# EAGLE design ESP8266-Thing-Dev (EAGLE 9.1.0)
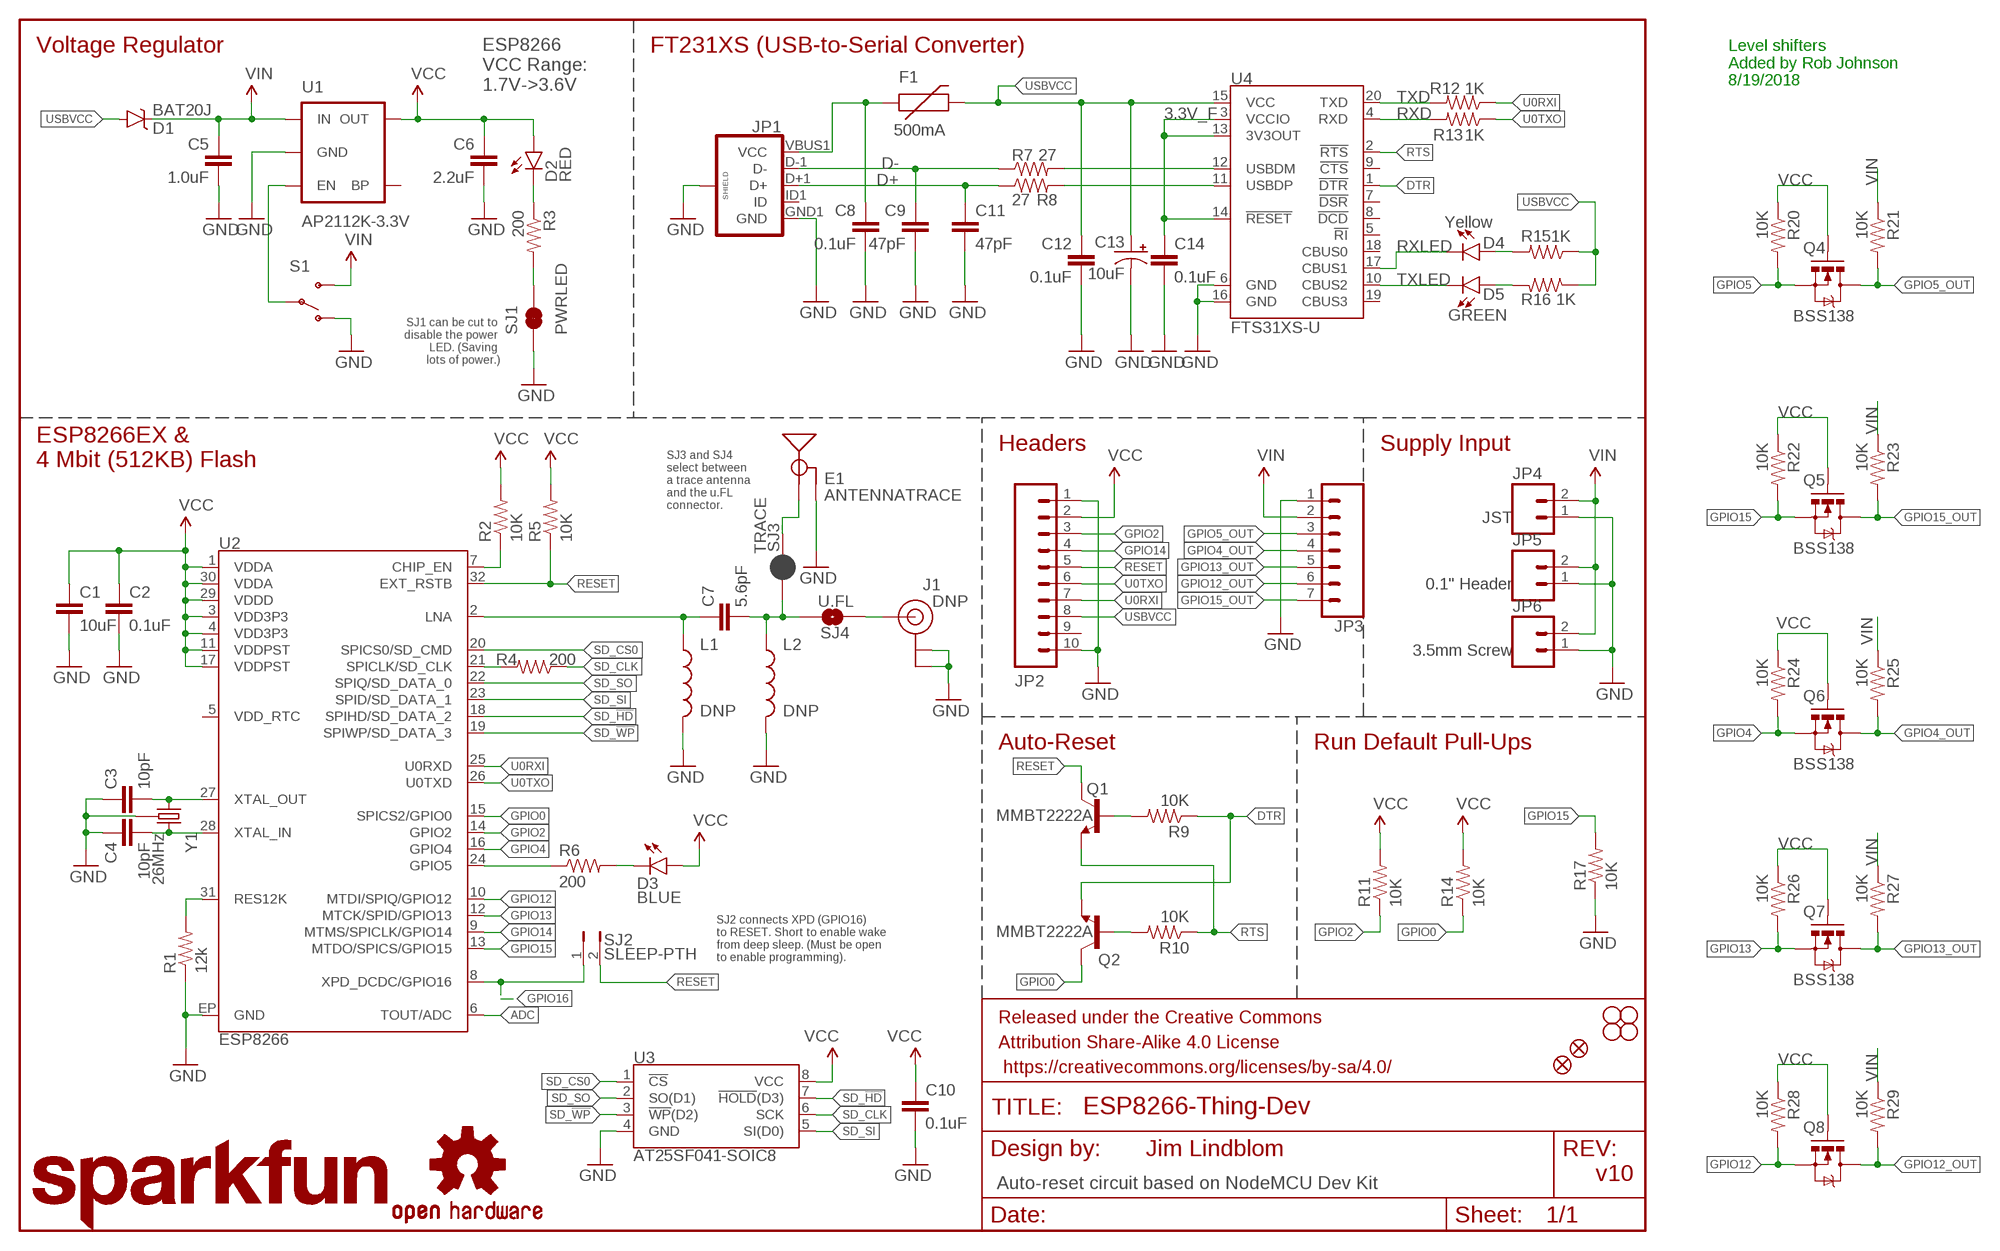
[diagram p0: schematic, sheet 1]

## Parts
C1  10uF  10UF-6.3V-20%(0603)  [0603-CAP]
C2  0.1uF  0.1UF-25V(+80/-20%)(0603)  [0603-CAP]
C3  10pF  10PF-50V-5%(0603)  [0603-CAP]
C4  10pF  10PF-50V-5%(0603)  [0603-CAP]
C5  1.0uF  1.0UF-25V-+80/-20(0805)  [0805]
C6  2.2uF  2.2UF-10V-20%(0603)  [0603-CAP]
C7  5.6pF  CAP0603-CAP  [0603-CAP]
C8  0.1uF  0.1UF-25V(+80/-20%)(0603)  [0603-CAP]
C9  47pF  47PF-50V-5%(0603)  [0603-CAP]
C10  0.1uF  0.1UF-25V(+80/-20%)(0603)  [0603-CAP]
C11  47pF  47PF-50V-5%(0603)  [0603-CAP]
C12  0.1uF  0.1UF-25V(+80/-20%)(0603)  [0603-CAP]
C13  10uF  10UF-16V-10%(TANT)  [EIA3216]
C14  0.1uF  0.1UF-25V(+80/-20%)(0603)  [0603-CAP]
D1  BAT20J  DIODE-SCHOTTKY-BAT20J  [SOD-323]
D2  RED  LED-RED0603  [LED-0603]
D3  BLUE  LED-BLUE0603  [LED-0603]
D4  Yellow  LED-YELLOW0603  [LED-0603]
D5  GREEN  LED-GREEN0603  [LED-0603]
E1  ANTENNATRACE  [TRACE_ANTENNA_2.4GHZ_25.7MM]
F1  500mA  PTCSMD  [PTC-1206]
FID1  FIDUCIAL1X2  [FIDUCIAL-1X2]
FID2  FIDUCIAL1X2  [FIDUCIAL-1X2]
FRAME1  FRAME-LETTER  [CREATIVE_COMMONS]
J1  DNP  U.FL  [U.FL]
JP1  USB_MICROB_PLUGCONN-11752  [USB-B-MICRO-SMD_V03]
JP2  M10NO_SILK_PTH_FEMALE  [1X10_NO_SILK]
JP3  CONN_07NO_SILK  [1X07_NO_SILK]
JP4  M02JST-PTH-2  [JST-2-PTH]
JP5  M021X02_NO_SILK  [1X02_NO_SILK]
JP6  M023.5MM-NO_SILK  [SCREWTERMINAL-3.5MM-2-NS]
L1  DNP  INDUCTOR0603  [0603]
L2  DNP  INDUCTOR0603  [0603]
LOGO1  SFE_LOGO_NAME.2_INCH  [SFE_LOGO_NAME_.2]
LOGO2  OSHW-LOGOS  [OSHW-LOGO-S]
Q1  MMBT2222A  TRANSISTOR_NPNMMBT2222A  [SOT23-3]
Q2  MMBT2222A  TRANSISTOR_NPNMMBT2222A  [SOT23-3]
Q4  BSS138  MOSFET-NCHANNELSMD  [SOT23-3]
Q5  BSS138  MOSFET-NCHANNELSMD  [SOT23-3]
Q6  BSS138  MOSFET-NCHANNELSMD  [SOT23-3]
Q7  BSS138  MOSFET-NCHANNELSMD  [SOT23-3]
Q8  BSS138  MOSFET-NCHANNELSMD  [SOT23-3]
R1  12k  12KOHM-1/10W-1%(0603)  [0603-RES]
R2  10K  10KOHM1/10W1%(0603)0603  [0603-RES]
R3  200  200OHM1/10W1%(0603)  [0603-RES]
R4  200  200OHM1/10W1%(0603)  [0603-RES]
R5  10K  10KOHM1/10W1%(0603)0603  [0603-RES]
R6  200  200OHM1/10W1%(0603)  [0603-RES]
R7  27  27OHM1/10W1%(0603)0603-RES  [0603-RES]
R8  27  27OHM1/10W1%(0603)0603-RES  [0603-RES]
R9  10K  10KOHM1/10W1%(0603)0603  [0603-RES]
R10  10K  10KOHM1/10W1%(0603)0603  [0603-RES]
R11  10K  10KOHM1/10W1%(0603)0603  [0603-RES]
R12  1K  1KOHM-1/10W-1%(0603)  [0603-RES]
R13  1K  1KOHM-1/10W-1%(0603)  [0603-RES]
R14  10K  10KOHM1/10W1%(0603)0603  [0603-RES]
R15  1K  1KOHM-1/10W-1%(0603)  [0603-RES]
R16  1K  1KOHM-1/10W-1%(0603)  [0603-RES]
R17  10K  10KOHM1/10W1%(0603)0603  [0603-RES]
R20  10K  RESISTOR0603-RES  [0603-RES]
R21  10K  RESISTOR0603-RES  [0603-RES]
R22  10K  RESISTOR0603-RES  [0603-RES]
R23  10K  RESISTOR0603-RES  [0603-RES]
R24  10K  RESISTOR0603-RES  [0603-RES]
R25  10K  RESISTOR0603-RES  [0603-RES]
R26  10K  RESISTOR0603-RES  [0603-RES]
R27  10K  RESISTOR0603-RES  [0603-RES]
R28  10K  RESISTOR0603-RES  [0603-RES]
R29  10K  RESISTOR0603-RES  [0603-RES]
S1  SWITCH-SPDT-SMD-A  [SWITCH-SPST-SMD-A]
SJ1  PWRLED  JUMPER-PAD-2-NC_BY_TRACE  [PAD-JUMPER-2-NC_BY_TRACE_YES_SILK]
SJ2  SLEEP-PTH  JUMPER-PTH-2-NO  [PTH-JUMPER-2-NO_NO_SILK]
SJ3  TRACE  JUMPER-PAD-2-NC_BY_PASTENO-SILK  [PAD-JUMPER-2-NC_BY_PASTE_NO_SILK]
SJ4  U.FL  JUMPER-PAD-2-NO  [PAD-JUMPER-2-NO_NO_SILK]
STANDOFF1  STAND-OFF  [STAND-OFF]
STANDOFF2  STAND-OFF  [STAND-OFF]
STANDOFF3  STAND-OFF  [STAND-OFF]
STANDOFF4  STAND-OFF  [STAND-OFF]
U1  AP2112K-3.3V  V_REG_LDOSMD  [SOT23-5]
U2  ESP8266  [QFN32]
U3  AT25SF041-SOIC8  [SO08]
U4  FTS31XS-U  FT231XS  [SSOP20_L]
Y1  26MHz  CRYSTAL-GROUNDED3.2X2.5  [CRYSTAL-SMD-3.2X2.5]

## Nets
3.3V_F: C14.1 U4.3(VCCIO) U4.13(3V3OUT) U4.14(!RESET)
ADC: U2.6(TOUT/ADC)
ANT: J1.P$3(SIGNAL) SJ4.1
CHIP_EN: R2.1 U2.7(CHIP_EN)
D+: C11.1 JP1.D+1(D+) R8.1
D-: C9.1 JP1.D-1(D-) R7.1
DTR: Q2.2(E) R9.1 U4.1(!DTR)
GND: C1.2 C2.2 C3.1 C4.1 C5.2 C6.2 C8.2 C9.2 C10.2 C11.2 C12.2 C13.C(-) C14.2 E1.GND E1.GND2(GND) J1.P$1(GND) J1.P$2(GND) JP1.GND1(GND) JP1.SHIELD1(SHIELD) JP1.SHIELD2(SHIELD) JP1.SHIELD3(SHIELD) JP2.1 JP2.10 JP3.1 JP4.1 JP5.1 JP6.1 L1.2 L2.2 R1.1 R17.1 S1.1(O) SJ1.1 U1.2(GND) U2.EP(GND) U3.4(GND) U4.6(GND) U4.16(GND) Y1.2(GND) Y1.4(GND)
GPIO0: Q2.3(C) R14.1 U2.15(SPICS2/GPIO0)
GPIO2: JP2.3 R11.1 U2.14(GPIO2)
GPIO4: Q6.2(S) R24.2 U2.16(GPIO4)
GPIO4_OUT: JP3.4 Q6.3(D) R25.2
GPIO5: Q4.2(S) R6.1 R20.2 U2.24(GPIO5)
GPIO5_OUT: JP3.3 Q4.3(D) R21.2
GPIO12: Q8.2(S) R28.2 U2.10(MTDI/SPIQ/GPIO12)
GPIO12_OUT: JP3.6 Q8.3(D) R29.2
GPIO13: Q7.2(S) R26.2 U2.12(MTCK/SPID/GPIO13)
GPIO13_OUT: JP3.5 Q7.3(D) R27.2
GPIO14: JP2.4 U2.9(MTMS/SPICLK/GPIO14)
GPIO15: Q5.2(S) R17.2 R22.2 U2.13(MTDO/SPICS/GPIO15)
GPIO15_OUT: JP3.7 Q5.3(D) R23.2
GPIO16: SJ2.1 U2.8(XPD_DCDC/GPIO16)
LNA: C7.1 L1.1 U2.2(LNA)
LNA2: C7.2 L2.1 SJ3.1 SJ4.2
N$1: R1.2 U2.31(RES12K)
N$2: C4.2 U2.28(XTAL_IN) Y1.3
N$3: C3.2 U2.27(XTAL_OUT) Y1.1
N$4: R7.2 U4.12(USBDM)
N$5: R3.2 SJ1.2
N$6: Q1.1(B) R9.2
N$7: R8.2 U4.11(USBDP)
N$8: D5.A R16.2
N$9: D3.C R6.2
N$10: D4.A R15.2
N$11: D2.C R3.1
N$12: Q2.1(B) R10.2
N$14: S1.2(P) U1.3(EN)
RESET: JP2.5 Q1.3(C) R5.1 SJ2.2 U2.32(EXT_RSTB)
RTS: Q1.2(E) R10.1 U4.2(!RTS)
RXD: R13.2 U4.4(RXD)
RXLED: D4.C U4.17(CBUS1)
SD_!HD!: U2.18(SPIHD/SD_DATA_2) U3.7(!HOLD!(D3))
SD_!WP!: U2.19(SPIWP/SD_DATA_3) U3.3(!WP!(D2))
SD_CLK: R4.1 U3.6(SCK)
SD_CLK0: R4.2 U2.21(SPICLK/SD_CLK)
SD_CS0: U2.20(SPICS0/SD_CMD) U3.1(!CS!)
SD_SI: U2.23(SPID/SD_DATA_1) U3.5(SI(D0))
SD_SO: U2.22(SPIQ/SD_DATA_0) U3.2(SO(D1))
TRACE_ANT: E1.ANT(SIGNAL) SJ3.2
TXD: R12.2 U4.20(TXD)
TXLED: D5.C U4.10(CBUS2)
U0RXI: JP2.7 R12.1 U2.25(U0RXD)
U0TXO: JP2.6 R13.1 U2.26(U0TXD)
USBVCC: C12.1 C13.A(+) D1.A F1.2 JP2.8 R15.1 R16.1 U4.15(VCC)
VCC: C1.1 C2.1 C6.1 C10.1 D2.A D3.A JP2.2 Q4.1(G) Q5.1(G) Q6.1(G) Q7.1(G) Q8.1(G) R2.2 R5.2 R11.2 R14.2 R20.1 R22.1 R24.1 R26.1 R28.1 U1.5(OUT) U2.1(VDDA) U2.3(VDD3P3) U2.4(VDD3P3) U2.11(VDDPST) U2.17(VDDPST) U2.29(VDDD) U2.30(VDDA) U3.8(VCC)
VIN: C5.1 D1.C JP3.2 JP4.2 JP5.2 JP6.2 R21.1 R23.1 R25.1 R27.1 R29.1 S1.3(S) U1.1(IN)
VUSB: C8.1 F1.1 JP1.VBUS1(VCC)
Unconnected: JP1.ID1(ID) JP2.9 U1.4(BP) U2.5(VDD_RTC) U4.5(!RI) U4.7(!DSR) U4.8(!DCD) U4.9(!CTS) U4.18(CBUS0) U4.19(CBUS3)

## Notes on the sheet
- Voltage Regulator | FT231XS (USB-to-Serial Converter)
- Level shifters
  Added by Rob Johnson
  8/19/2018
- ESP8266
  VCC Range:
  1.7V->3.6V
- SJ1 can be cut to 
  disable the power 
  LED. (Saving 
  lots of power.)
- SJ3 and SJ4
  select between
  a trace antenna
  and the u.FL 
  connector.
- Headers | Supply Input
- ESP8266EX &
  4 Mbit (512KB) Flash
- JST
- 0.1" Header
- DNP
- 3.5mm Screw
- Auto-Reset | Run Default Pull-Ups
- SJ2 connects XPD (GPIO16) 
  to RESET. Short to enable wake 
  from deep sleep. (Must be open
  to enable programming).
- Jim Lindblom
- v10
- Auto-reset circuit based on NodeMCU Dev Kit

## Library data of the parts
C1 = SparkFun-Capacitors:10UF-6.3V-20%(0603): CAP-11015; PROD_ID: CAP-11015
C2 C8 C10 C12 C14 = SparkFun-Capacitors:0.1UF-25V(+80/-20%)(0603): CAP-00810 Ceramic Standard decoupling cap; PROD_ID: CAP-00810
C3 C4 = SparkFun-Capacitors:10PF-50V-5%(0603): CAP-11812; PROD_ID: CAP-11812
C5 = SparkFun-Capacitors:1.0UF-25V-+80/-20(0805): CAP-11625; PROD_ID: CAP-11625
C6 = SparkFun-Capacitors:2.2UF-10V-20%(0603): CAP-07888; PROD_ID: CAP-07888
C7 = SparkFun-Capacitors:CAP: Capacitor Standard 0603 ceramic capacitor, and 0.1" leaded capacitor.; PROD_ID: CAP-12456
C9 C11 = SparkFun-Capacitors:47PF-50V-5%(0603): CAP-08913; PROD_ID: CAP-08913
C13 = SparkFun-Capacitors:10UF-16V-10%(TANT): CAP-00811 1206/EIA-3216 Tantalum capacitor; PROD_ID: CAP-00811
D1 = SparkFun-DiscreteSemi:DIODE-SCHOTTKY: Schottky diodes in SFE's production catalog BAT20J 1A 23V 0.62Vf RB751 120mA 40V 0.37Vf PMEG4005EJ 0.5A 40V 0.42Vf MBRA140 1A 40V 0.5Vf B340A 3A 40V SMA; PROD_ID: DIO-11623
D2 = SparkFun-LED:LED-RED: Assorted Red LEDs LilyPad 1206- DIO-09912 1206- DIO-00809 0603- DIO-00819 "SMART" means more efficient and expensive; PROD_ID: DIO-00819
D3 = SparkFun-LED:LED-BLUE: Blue LEDs for production use Various blue LEDs stocked by SparkFun production 0603 - DIO-08575 Rebel - DIO-09553 1206 - DIO-09911; PROD_ID: DIO-08575
D4 = SparkFun-LED:LED-YELLOW: Yellow SMD LEDs LilyPad 1206- DIO-09909 0603- DIO-09003 "SMART" means more efficient and expensive; PROD_ID: DIO-09003
D5 = SparkFun-LED:LED-GREEN: Various green LEDs Green LEDs used in SFE Production 0603- DIO-00821 LARGE- DIO-00862 LILYPAD- DIO-09910; PROD_ID: DIO-00821
E1 = SparkFun-RF:ANTENNA: Chip antenna Chip antenna with ground or secondary connection. Common with larger metal RF connectors.
F1 = SparkFun-PowerIC:PTC: Resettable Fuse PTC Resettable Fuse. Spark Fun Electronics SKU : COM-08357; PROD_ID: RES-11150
FID1 FID2 = SparkFun-Aesthetics:FIDUCIAL: Fiducial Alignment Points Various fiducial points for machine vision alignment.
FRAME1 = SparkFun-Aesthetics:FRAME-LETTER: Schematic Frame Standard 8.5x11 US Letter frame
J1 = SparkFun-Connectors:U.FL: SMD antenna connector- WRL-09144; PROD_ID: CONN-09193; VALUE: U.FL
JP1 = SparkFun-Connectors:USB_MICROB_PLUG: USB Micro-B connectors Some male, some female. Watch your step!; PROD_ID: CONN-11752
JP2 = SparkFun-Connectors:M10: Header 10 Standard 10-pin 0.1" header. Use with straight break away headers (SKU : PRT-00116), right angle break away headers (PRT-00553), swiss pins (PRT-00743), machine pins (PRT-00117), and female headers (PRT-00115).; PROD_ID: CONN-11563
JP3 = SparkFun-Connectors:CONN_07: Multi connection point. Often used as Generic Header-pin footprint for 0.1 inch spaced/style header connections On any of the 0.1 inch spaced packages, you can populate with these: Break Away Headers - Straight <https://www.sparkfun.com/products/116> (PRT-00116) Break Away Male Headers - Right Angle <https://www.sparkfun.com/products/553> (PRT-00553) Female Headers <https://www.sparkfun.com/products/115> (PRT-00115) Break Away Headers - Machine Pin <https://www.sparkfun.com/products/117> (PRT-00117) Break Away Female Headers - Swiss Machine Pin <https://www.sparkfun.com/products/743> (PRT-00743) For SCREWTERMINALS and SPRING TERMINALS visit here: Screw Terimnals on SparkFun.com <https://www.sparkfun.com/search/results?term=Screw+Terminals> (5mm/3.5mm/2.54mm spacing) This device is also useful as a general connection point to wire up your design to another part of your project. Our various solder wires solder well into these plated through hole pads. Hook-Up Wire - Assortment (Stranded, 22 AWG) <https://www.sparkfun.com/products/11375> (PRT-11375) Hook-Up Wire - Assortment (Solid Core, 22 AWG) <https://www.sparkfun.com/products/11367> (PRT-11367) View the entire wire category on our website here <https://www.sparkfun.com/categories/141> Special notes: Molex polarized connector foot print use with SKU : PRT-08231 with associated crimp pins and housings. 1MM SMD Version SKU: PRT-10208 NOTES ON THE VARIANTS LOCK and LOCK_LONGPADS... This footprint was designed to help hold the alignment of a through-hole component (i.e. 6-pin header) while soldering it into place. You may notice that each hole has been shifted either up or down by 0.005 of an inch from it's more standard position (which is a perfectly straight line). This slight alteration caused the pins (the squares in the middle) to touch the edges of the holes. Because they are alternating, it causes a "brace" to hold the component in place. 0.005 has proven to be the perfect amount of "off-center" position when using our standard breakaway headers. Although looks a little odd when you look at the bare footprint, once you have a header in there, the alteration is very hard to notice. Also,if you push a header all the way into place, it is covered up entirely on the bottom side.
JP4 = SparkFun-Connectors:M02: Standard 2-pin 0.1" header. Use with - straight break away headers ( PRT-00116) - right angle break away headers (PRT-00553) - swiss pins (PRT-00743) - machine pins (PRT-00117) - female headers (PRT-00115) Molex polarized connector foot print use with: PRT-08233 with associated crimp pins and housings. 2.54_SCREWTERM for use with PRT-10571. 3.5mm Screw Terminal footprints for PRT-08084 5mm Screw Terminal footprints for use with PRT-08432; PROD_ID: CONN-09863; SKU: PRT-09914
JP5 = SparkFun-Connectors:M02: Standard 2-pin 0.1" header. Use with - straight break away headers ( PRT-00116) - right angle break away headers (PRT-00553) - swiss pins (PRT-00743) - machine pins (PRT-00117) - female headers (PRT-00115) Molex polarized connector foot print use with: PRT-08233 with associated crimp pins and housings. 2.54_SCREWTERM for use with PRT-10571. 3.5mm Screw Terminal footprints for PRT-08084 5mm Screw Terminal footprints for use with PRT-08432
JP6 = SparkFun-Connectors:M02: Standard 2-pin 0.1" header. Use with - straight break away headers ( PRT-00116) - right angle break away headers (PRT-00553) - swiss pins (PRT-00743) - machine pins (PRT-00117) - female headers (PRT-00115) Molex polarized connector foot print use with: PRT-08233 with associated crimp pins and housings. 2.54_SCREWTERM for use with PRT-10571. 3.5mm Screw Terminal footprints for PRT-08084 5mm Screw Terminal footprints for use with PRT-08432; PROD_ID: CONN-08399
L1 L2 = SparkFun-Passives:INDUCTOR: Inductors Basic Inductor/Choke - 0603 and 1206. Footprints are not proven and vary greatly between part numbers. INDUCTOR POWER 3.3UH 4.0A SMD 0.197" L x 0.197" W x 0.177" H (5.00mm x 5.00mm x 4.50mm)
LOGO1 = SparkFun-Aesthetics:SFE_LOGO_NAME: SFE Logo, name only This is the SparkFun name logo. The logo on the schematic will always be the same size; the package variant is the height of the flame part of the logo (or the height the flame would be, if it were drawn). Default layer for the logo on the board is tSilk.
LOGO2 = SparkFun-Aesthetics:OSHW-LOGO: Open Source Hardware Logo This logo indicates the piece of hardware it is found on incorporates a OSHW license and/or adheres to the definition of open source hardware found here: http://freedomdefined.org/OSHW
Q1 Q2 = SparkFun-DiscreteSemi:TRANSISTOR_NPN: Generic NPN BJT MMBT2222A - TRANS-08049 (SOT-23, 1A 40V) MPSA42 - TRANS-09116 (SOT-23, 500mA 300V) MMBT5088LT1G - TRANS-11160 (SOT-23, 50 mA 30V) BC547 - COM-08928 <http://www.sparkfun.com/products/8928> (TO-92 45V 100mA) (1.Collector 2.Base 3.Emitter) 2N3904 - COM-00521 <http://www.sparkfun.com/products/521> (TO-92 40V 200mA) (1.Emitter 2.Base 3.Collector) P2N2222A - COM-12852 <http://www.sparkfun.com/products/12852> (TO-92 40V 600mA) (1.Collector 2.Base 3.Emitter); PROD_ID: TRANS-08049
Q4-Q8 = SparkFun:MOSFET-NCHANNEL
R1 = SparkFun-Resistors:12KOHM-1/10W-1%(0603): RES-10327; PROD_ID: RES-10327
R2 R5 R9-R11 R14 R17 = SparkFun-Resistors:10KOHM1/10W1%(0603): RES-00824; PROD_ID: RES-00824
R3 R4 R6 = SparkFun-Resistors:200OHM1/10W1%(0603): RES-08220; PROD_ID: RES-08220
R7 R8 = SparkFun-Resistors:27OHM1/10W1%(0603): RES-09334; PROD_ID: RES-09334
R12 R13 R15 R16 = SparkFun-Resistors:1KOHM-1/10W-1%(0603): RES-07856; PROD_ID: RES-07856
R20-R29 = SparkFun:RESISTOR: Resistor Basic schematic elements and footprints for 0603, 1206, and PTH resistors.
S1 = SparkFun-Electromechanical:SWITCH-SPDT: SPDT Switch Simple slide switch, Spark Fun Electronics SKU : COM-00102 DPDT SMT slide switch, AYZ0202, SWCH-08179; PROD_ID: SWCH-10651
SJ1 = SparkFun-Passives:JUMPER-PAD-2-NC_BY_TRACE
SJ2 = SparkFun-Passives:JUMPER-PTH-2-NO
SJ3 = SparkFun-Passives:JUMPER-PAD-2-NC_BY_PASTE
SJ4 = SparkFun-Passives:JUMPER-PAD-2-NO
STANDOFF1-STANDOFF4 = SparkFun-Electromechanical:STAND-OFF: #4 Stand Off This is the mechanical footprint for a #4 phillips button head screw. Use the keepout ring to avoid running the screw head into surrounding components. SKU : PRT-00447
U1 = SparkFun-PowerIC:V_REG_LDO: Voltage Regulator LDO Standard 150mA LDO voltage regulator in SOT-23 layout. Micrel part MIC5205. BP (by-pass) pin is used to lower output noise with 470pF cap.; PROD_ID: VREG-12457
U2 = esp8266-development-board:ESP8266: Espressif ESP8266 WiFi Smart Connectivity Platform.; PROD_ID: IC-12452
U3 = esp8266-development-board:AT25SF041: SPI Serial Flash Memory with Dual/Quad-IO Support Example: Adesto Technologies AT25SF041-SSHD-T (1265-1131-1-ND) <http://www.digikey.com/product-detail/en/AT25SF041-SSHD-T/1265-1131-1-ND/4824165>; PROD_ID: IC-12455
U4 = SparkFun-DigitalIC:FT231X: FTDI FT231X Full Speed USB to Full-handshake UART This USB2.0 Full Speed IC offers a compact bridge to full handshake UART interfaces. The device is a UART, capable of operating up to 3MBaud, with low power consumption (8mA). The FT231X includes the complete FT-X series feature set and enables USB to be added into a system design quickly and easily over a UART interface.; PROD_ID: IC-11524
Y1 = things:CRYSTAL-GROUNDED; PROD_ID: XTAL-12454

## Board
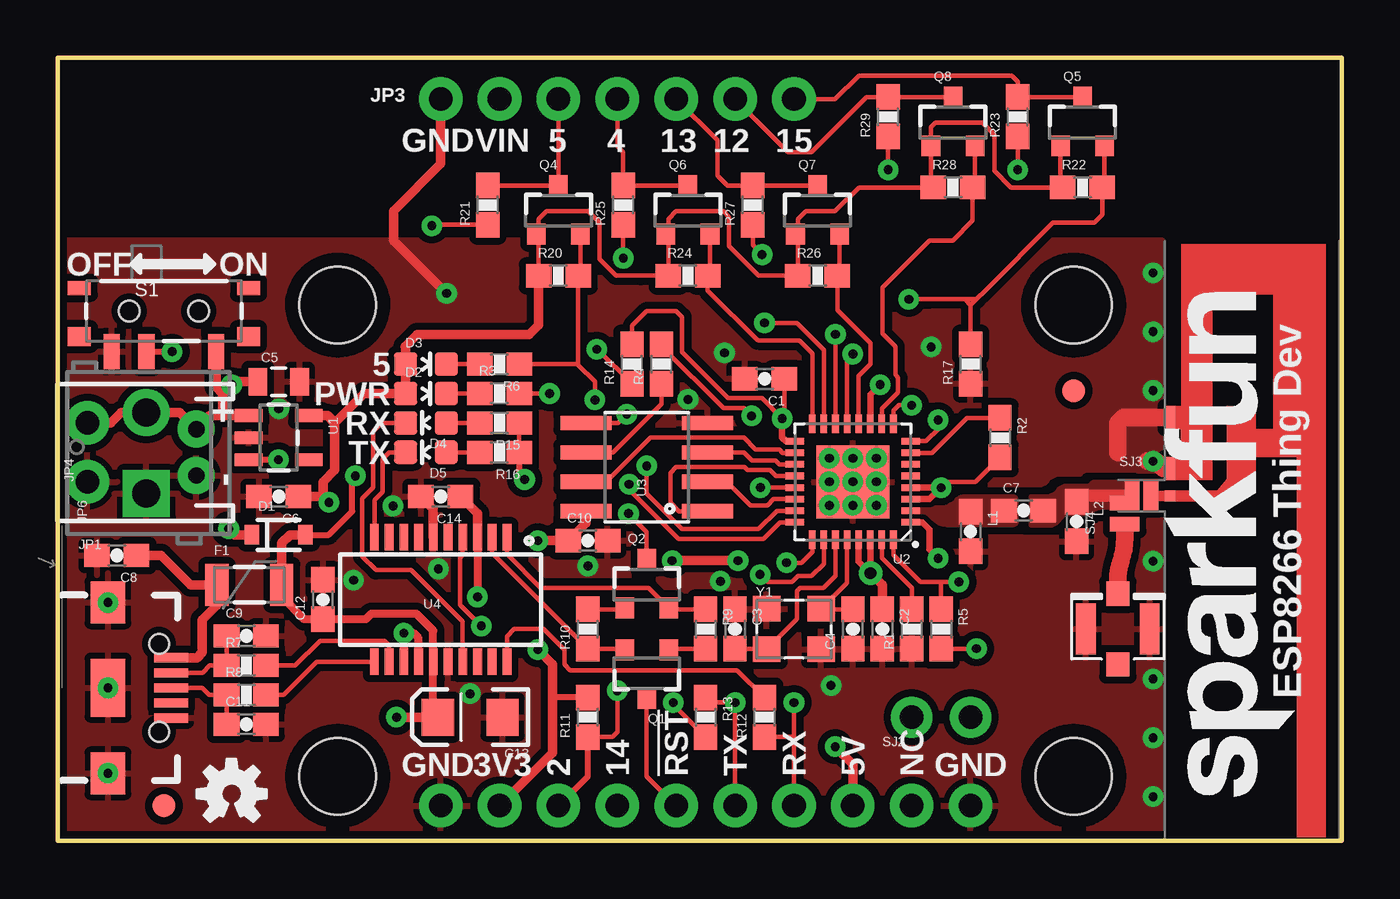
[diagram p1: board, top side]
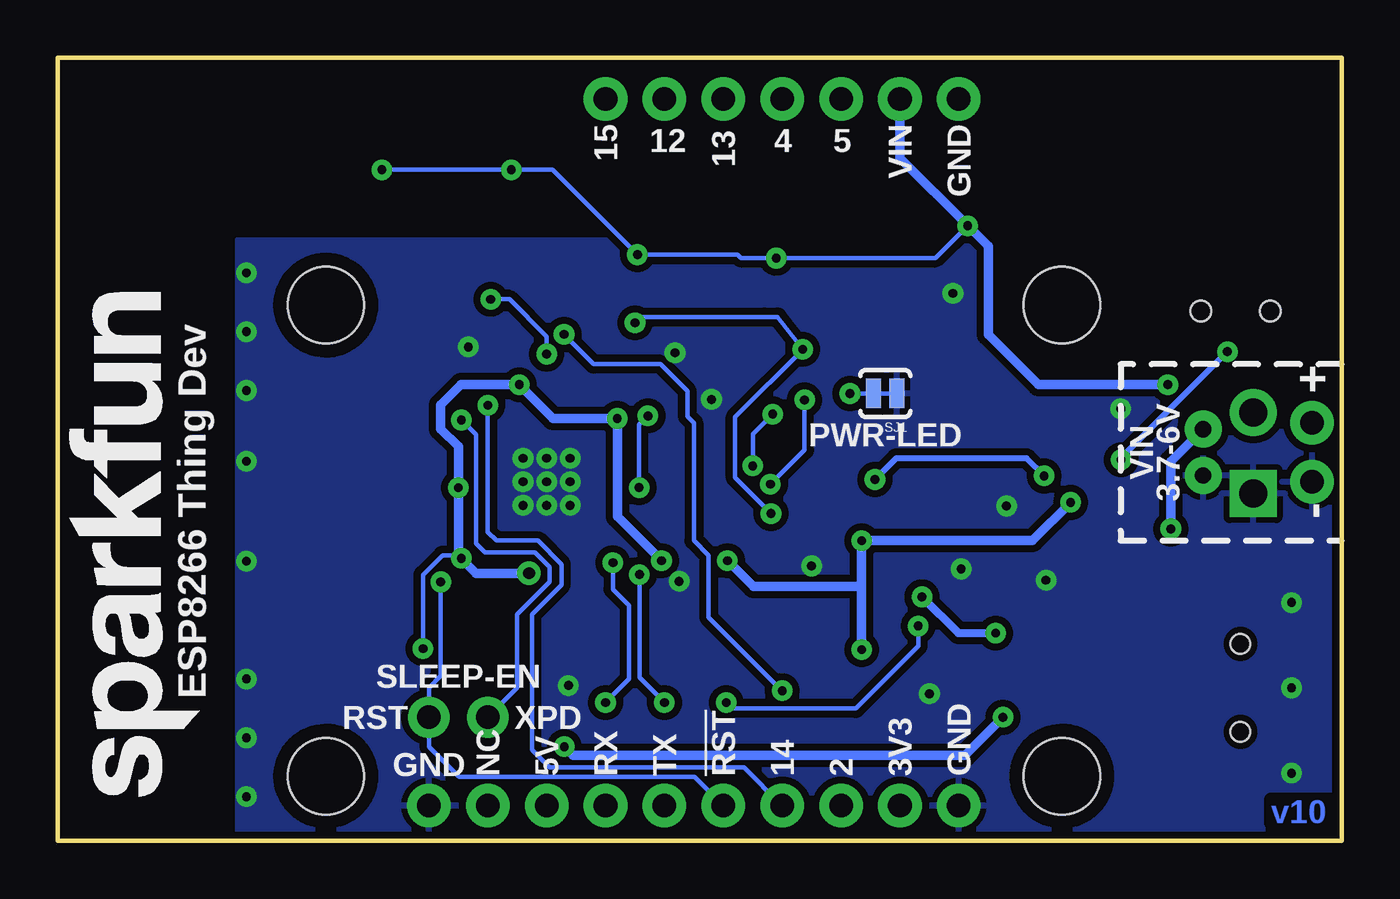
[diagram p2: board, bottom side, seen from below]

Size 55.37 x 33.78 mm. Coordinates in mm from the lower left corner, seen from the top.
Outline: 0,0 0,33.78 55.37,33.78 55.37,0 0,0
Copper layers (1*16): Top 0.035mm / dielectric 1.5mm / Bottom 0.035mm
Design rules "SparkFun *": minimum track width 8mil, minimum drill 15mil, track to track 8mil, track to pad 8mil, pad to pad 8mil, via to via 8mil, smd to smd 8mil, copper to edge 10mil, drill to drill 8mil, minimum pad ring 12mil, minimum via ring 10mil, stop-mask expansion 4mil, vias tented up to drill 25mil, thermal gap 10mil

### Footprints (pad centres in the part's own frame; a part is rotated, then mirrored left to right if it is on the bottom)
0603-CAP = smd 1.1 x 1: 1 -0.85,0; 2 0.85,0
0805 = smd 0.8 x 1.2: 1 -0.9,0; 2 0.9,0
EIA3216 = smd 1.4 x 1.6: A 1.4,0; C -1.4,0
SOD-323 = smd 0.63 x 0.83: A 1.15,0; C -1.15,0
LED-0603 = smd 1 x 1: A 0,-0.877; C 0,0.877
TRACE_ANTENNA_2.4GHZ_25.7MM = smd 0.46 x 0.46: ANT 0,0.23 | smd 1 x 0.46: GND -1.18,0.23; GND2 -3.38,0.23
PTC-1206 = smd 1 x 1.8: 1 -1.4,0; 2 1.4,0
FIDUCIAL-1X2 = smd 1 x 1: 1 0,0
U.FL = smd 2.2 x 0.85: P$1 0,1.375; P$2 0,-1.375 | smd 1.05 x 1: P$3 1.525,0; P$4 -1.525,0
USB-B-MICRO-SMD_V03 = smd 1.45 x 0.4: D+1 2.725,0; D-1 2.725,0.65; GND1 2.725,-1.3; ID1 2.725,-0.65; VBUS1 2.725,1.3 | smd 1.5 x 1.8: SHIELD1 0,3.685; SHIELD2 0,-3.685 | smd 1.5 x 2.5: SHIELD3 0,0 | hole 0.85: 2.2,1.9; 2.2,-1.9
1X10_NO_SILK = drill 1.016 pad 1.88: 1 0,0; 2 2.54,0; 3 5.08,0; 4 7.62,0; 5 10.16,0; 6 12.7,0; 7 15.24,0; 8 17.78,0; 9 20.32,0; 10 22.86,0
1X07_NO_SILK = drill 1.016 pad 1.88: 1 0,0; 2 2.54,0; 3 5.08,0; 4 7.62,0; 5 10.16,0; 6 12.7,0; 7 15.24,0
JST-2-PTH = drill 0.7 pad 1.6: 1 -1,0; 2 1,0
1X02_NO_SILK = drill 1.016 pad 1.88: 1 0,0; 2 2.54,0
SCREWTERMINAL-3.5MM-2-NS = drill 1.2 pad 2.032 square: 1 0,0 | drill 1.2 pad 2.032: 2 3.5,0
0603 = smd 1.1 x 1: 1 -0.85,0; 2 0.85,0
SOT23-3 = smd 0.8 x 0.9: 1 -0.95,-1; 2 0.95,-1; 3 0,1.1
0603-RES = smd 1.1 x 1: 1 -0.85,0; 2 0.85,0
SWITCH-SPST-SMD-A = smd 0.7 x 1.5: 1 -2.25,-1.75; 2 -0.75,-1.75; 3 2.25,-1.75 | smd 1 x 0.6: GND1 -3.65,1; GND3 3.65,1 | smd 1 x 0.8: GND2 -3.65,-1.1; GND4 3.65,-1.1 | hole 0.9: -1.5,0; 1.5,0
PAD-JUMPER-2-NC_BY_TRACE_YES_SILK = smd 0.635 x 1.27: 1 -0.508,0; 2 0.508,0
PTH-JUMPER-2-NO_NO_SILK = drill 1.016 pad 1.778: 1 -1.27,0; 2 1.27,0
PAD-JUMPER-2-NC_BY_PASTE_NO_SILK = smd 0.635 x 1.27: 1 -0.401,0; 2 0.413,0
PAD-JUMPER-2-NO_NO_SILK = smd 0.635 x 1.27: 1 -0.45,0; 2 0.45,0
STAND-OFF = hole 3.302: 0,0
SOT23-5 = smd 0.55 x 1.2: 1 -0.95,-1.3; 2 0,-1.3; 3 0.95,-1.3; 4 0.95,1.3; 5 -0.95,1.3
QFN32 = smd 0.8 x 0.285: 1 -2.5,1.75; 2 -2.5,1.25; 3 -2.5,0.75; 4 -2.5,0.25; 5 -2.5,-0.25; 6 -2.5,-0.75; 7 -2.5,-1.25; 8 -2.5,-1.75; 17 2.5,-1.75; 18 2.5,-1.25; 19 2.5,-0.75; 20 2.5,-0.25; 21 2.5,0.25; 22 2.5,0.75; 23 2.5,1.25; 24 2.5,1.75 | smd 0.285 x 0.8: 9 -1.75,-2.5; 10 -1.25,-2.5; 11 -0.75,-2.5; 12 -0.25,-2.5; 13 0.25,-2.5; 14 0.75,-2.5; 15 1.25,-2.5; 16 1.75,-2.5; 25 1.75,2.5; 26 1.25,2.5; 27 0.75,2.5; 28 0.25,2.5; 29 -0.25,2.5; 30 -0.75,2.5; 31 -1.25,2.5; 32 -1.75,2.5 | smd 3.15 x 3.15: EP 0,0
SO08 = smd 0.61 x 2.21: 1 -1.905,-2.616; 2 -0.635,-2.616; 3 0.635,-2.616; 4 1.905,-2.616; 5 1.905,2.616; 6 0.635,2.616; 7 -0.635,2.616; 8 -1.905,2.616
SSOP20_L = smd 0.381 x 1.143: 1 -2.857,-2.68; 2 -2.223,-2.68; 3 -1.587,-2.68; 4 -0.953,-2.68; 5 -0.318,-2.68; 6 0.318,-2.68; 7 0.953,-2.68; 8 1.587,-2.68; 9 2.223,-2.68; 10 2.857,-2.68; 11 2.857,2.68; 12 2.223,2.68; 13 1.587,2.68; 14 0.953,2.68; 15 0.318,2.68; 16 -0.318,2.68; 17 -0.953,2.68; 18 -1.587,2.68; 19 -2.223,2.68; 20 -2.857,2.68
CRYSTAL-SMD-3.2X2.5 = smd 1.2 x 1.1: 1 -1.175,-0.875; 2 1.175,-0.875; 3 1.175,0.875; 4 -1.175,0.875

### Placement (x,y rotation side)
C1  30.48,19.94 180 top
C2  35.56,9.14 270 top
C3  29.21,9.14 270 top
C4  34.29,9.14 90 top
C5  9.53,19.81 0 top
C6  9.53,14.86 180 top
C7  41.66,14.25 0 top
C8  2.54,12.32 180 top
C9  8.13,8.84 0 top
C10  22.86,12.95 0 top
C11  8.13,5.03 0 top
C12  11.43,10.41 90 top
C13  17.78,5.33 180 top
C14  16.51,14.86 180 top
D1  9.53,13.21 0 top
D2  15.88,19.3 270 top
D3  15.88,20.57 270 top
D4  15.88,18.03 90 top
D5  15.88,16.76 90 top
E1  47.75,14.88 270 top
F1  8.26,11.05 0 top
FID1  43.81,19.43 0 top
FID2  4.57,1.52 0 top
FRAME1  -5.08,-21.34 0 top  (outside the outline)
J1  45.72,9.14 90 top
JP1  2.16,6.6 0 top
JP2  16.51,1.52 0 top
JP3  16.51,32 0 top
JP4  5.97,16.76 90 top
JP5  1.27,15.49 90 top
JP6  3.81,14.99 90 top
L1  39.37,13.35 270 top
L2  43.94,13.78 270 top
LOGO1  53.34,1.91 90 top
LOGO2  7.49,2.03 0 top
LOGO3  SFE_LOGO_NAME.2_INCH  [SFE_LOGO_NAME_.2]  49.28,1.91 90 bottom
Q1  25.4,7.24 180 top
Q2  25.4,11.05 0 top
Q4  21.59,27.18 0 top
Q5  44.2,30.99 0 top
Q6  27.18,27.18 0 top
Q7  32.77,27.18 0 top
Q8  38.61,30.99 0 top
R1  36.83,9.14 90 top
R2  40.64,17.4 270 top
R3  19.05,19.3 0 top
R4  26.04,20.57 90 top
R5  38.1,9.14 270 top
R6  19.05,20.57 180 top
R7  8.13,7.57 0 top
R8  8.13,6.3 0 top
R9  27.94,9.14 270 top
R10  22.86,9.14 90 top
R11  22.86,5.33 90 top
R12  30.48,5.33 90 top
R13  27.94,5.33 270 top
R14  24.77,20.57 90 top
R15  19.05,18.03 180 top
R16  19.05,16.76 180 top
R17  39.37,20.57 90 top
R20  21.59,24.38 0 top
R21  18.54,27.43 90 top
R22  44.2,28.19 0 top
R23  41.4,31.24 90 top
R24  27.18,24.38 0 top
R25  24.38,27.43 90 top
R26  32.77,24.38 0 top
R27  29.97,27.43 90 top
R28  38.61,28.19 0 top
R29  35.81,31.24 90 top
S1  4.57,22.86 0 top
SJ1  19.68,19.3 180 bottom
SJ2  38.1,5.33 0 top
SJ3  46.74,14.88 0 top
SJ4  46.02,14.12 90 top
STANDOFF1  43.81,2.79 0 top
STANDOFF2  12.06,23.11 0 top
STANDOFF3  43.81,23.11 0 top
STANDOFF4  12.06,2.79 0 top
U1  9.53,17.4 270 top
U2  34.29,15.49 180 top
U3  25.4,16.13 90 top
U4  16.51,10.41 180 top
Y1  31.75,9.14 0 top

### Tracks (layer width: path | path; a pad name or v marks a point on that pad's centre or on a via)
3.3V_F  (via drill 0.38)
  Top 0.356: U4.13 v14.92,8.97 15.34,8.97 15.56,8.75 U4.14 | U4.3 v18.1,10.53
  Top 0.406: U4.3 18.1,14.12 C14.1
  Bottom 0.356: v18.1,10.53 16.54,8.97 v14.92,8.97
ANT
  Top 0.508: 46.02,13.33 SJ4.1
  Top 0.762: J1.P$3 45.72,11.3 arc-19 45.85,12.06 arc23 46.02,13.33
CHIP_EN
  Top 0.203: U2.7 37.7,16.74 39.2,18.25 R2.1
D+
  Top 0.203: JP1.D+1 6.22,6.6 6.53,6.3 R8.1 C11.1
D-
  Top 0.203: JP1.D-1 6.24,7.25 6.55,7.57 R7.1 C9.1
DTR
  Top 0.203: R9.1 26.41,9.99 Q2.2 25.48,10.92 20.83,10.92 19.37,12.38 U4.1
GND  (via drill 0.38)
  Top 0.406: U4.6 16.19,14.33 C14.2 | JP3.1 16.51,29.21 14.48,27.18 14.48,25.91 v16.76,23.62
  Top 0.762: E1.GND2 45.95,18.26 45.72,18.03 45.72,16.76 | 46.99,16.38 47.37,16.38 47.69,16.06 E1.GND
  other vias: 34.29,15.49 34.29,16.51 34.29,14.48 33.27,15.49 33.27,16.51 33.27,14.48 35.31,16.51 35.31,15.49 35.31,14.48 2.16,6.6 2.16,10.29 2.16,2.92 33.35,6.71 27.18,19.05 22.86,11.86 28.57,11.2 28.75,21.06 37.67,21.31 12.75,11.25 16.41,11.73 17.78,6.35 14.45,14.45 9.53,18.64 47.24,12.06 47.24,6.98 47.24,4.45 47.24,1.91 47.24,16.38 47.24,19.43 47.24,21.97 47.24,24.51
  pour Bottom (isolate 0.305, rank 6): 0,0 0,25.91 47.62,25.91 47.62,0
  pour Top (isolate 0.305, rank 6): 0,0 47.62,0 47.62,25.91 0,25.91 0,25.91
GPIO0  (via drill 0.38)
  Top 0.203: v30.48,22.35 31.88,22.35 33.04,21.19 U2.15 | Q2.3 25.4,13.33 v24.61,14.12 | R14.1 23.28,21.21 v23.24,21.21
  Bottom 0.203: v24.61,14.12 26.16,15.67 26.16,18.29 v23.24,21.21 24.33,22.61 24.89,22.61 30.23,22.61 v30.48,22.35
GPIO2  (via drill 0.38)
  Top 0.203: U2.14 v33.54,21.86 | R11.1 23.91,4.48 24.13,4.7 v24.13,6.48
  Top 0.254: JP2.3 22.86,2.79 R11.1
  Bottom 0.203: v24.13,6.48 27.3,9.65 27.3,12.32 27.94,12.95 27.94,18.03 28.22,18.31 28.22,19.41 29.39,20.57 32.26,20.57 v33.54,21.86
GPIO4
  Top 0.203: U2.16 32.54,21.03 31.98,21.59 30.23,21.59 30.21,21.6 30.17,21.6 28.03,23.74 R24.2 28.13,24.38 Q6.2
GPIO4_OUT
  Top 0.203: Q6.3 R25.2 24.38,29.72 24.13,29.97 JP3.4
GPIO5  (via drill 0.38)
  Top 0.203: U2.24 31.14,13.74 30.43,13.03 26.77,13.03 24.64,15.16 v24.64,15.39 | v23.16,19.03 23.16,19.81 22.44,20.54 | 22.44,20.54 22.4,20.57 R6.1 | Q4.2 22.54,24.38 R20.2 22.44,20.54
  Bottom 0.203: v23.16,19.03 23.16,16.87 v24.64,15.39
GPIO5_OUT
  Top 0.203: R21.2 Q4.3 JP3.3
GPIO12
  Top 0.203: U2.10 35.54,18.65 36.25,19.36 36.25,19.99 36.12,20.12 36.12,21.34 35.76,21.69 35.56,21.89 35.56,23.88 37.59,25.91 38.61,25.91 39.46,26.76 R28.2 39.56,28.29 Q8.2
GPIO12_OUT
  Top 0.203: JP3.6 31.5,29.72 32.51,29.72 34.89,32.09 R29.2 Q8.3
GPIO13
  Top 0.203: U2.12 34.54,20.06 35.05,20.57 35.05,21.49 33.63,22.91 33.63,24.37 R26.2 33.72,24.38 Q7.2
GPIO13_OUT
  Top 0.203: Q7.3 R27.2 | R27.2 | JP3.5 28.45,30.23 28.45,28.7 28.87,28.28 R27.2
GPIO14  (via drill 0.38)
  Top 0.203: U2.9 36.04,18.57 36.27,18.8 v36.83,18.8
  Bottom 0.203: v36.83,18.8 36.83,13.33 36.45,12.95 34.67,12.95 33.66,11.94 33.66,11.05 34.92,9.78 34.92,3.94 34.16,3.17 25.78,3.17 JP2.4
GPIO15  (via drill 0.38)
  Top 0.203: U2.13 34.04,20.76 v34.29,21.01 | Q5.2 45.15,28.29 R22.2 45.05,27.01 44.7,26.67 42.93,26.67 40.01,23.75 39.62,23.37 | 39.37,23.11 R17.2 | 39.62,23.37 39.37,23.11 | 39.12,23.37 37.59,23.37 v36.7,23.37 | 39.12,23.37 39.62,23.37 | 39.37,23.11 39.12,23.37
  Bottom 0.203: v36.7,23.37 35.89,23.37 34.29,21.77 v34.29,21.01
GPIO15_OUT
  Top 0.203: JP3.7 33.53,32 34.54,33.02 41.15,33.02 41.4,32.77 R23.2 Q5.3
GPIO16  (via drill 0.38)
  Top 0.203: v37.97,18.16 37.97,17.78 37.47,17.27 37.44,17.24 U2.8
  Bottom 0.203: v37.97,18.16 37.34,17.53 37.34,12.83 36.96,12.45 34.8,12.45 34.16,11.81 34.16,11.18 35.56,9.78 35.56,6.6 SJ2.1
LNA
  pour Top (no thermals): 36.7,14.38 38.06,14.38 arc43 38.73,14.66 arc-43 39.05,14.86 41.19,14.86 arc-90 41.35,14.69 41.35,13.8 arc-90 41.24,13.64 38.33,13.64 arc-41 37.88,13.81 37.73,13.94 arc41 37.29,14.11 36.7,14.11
LNA2
  Top 0.508: SJ3.1 44.2,14.88 L2.1
  pour Top (isolate 0.305, no thermals): 41.96,13.61 42.86,13.61 arc43 43.2,13.88 43.35,14.02 arc-43 43.55,14.1 44.41,14.1 arc36 44.48,14.12 44.72,14.3 arc-36 44.97,14.38 46.18,14.38 46.18,15.49 44.79,15.49 arc25 44.62,15.46 44.51,15.34 arc-25 44.38,15.32 43.62,15.32 arc50 43.19,15.17 43.16,15.14 arc-50 42.69,14.86 41.96,14.86
N$1
  Top 0.203: U2.31 35.54,12.21 36.83,10.92 36.83,10.79 36.83,10.41 R1.2
N$2
  Top 0.203: U2.28 34.04,11.13 33.17,10.26 | 33.17,10.26 Y1.3 | C4.2 33.17,9.99 33.17,10.26
N$3
  Top 0.203: U2.27 33.54,11.44 33.02,10.92 32,10.92 31.88,10.79 31.88,9.57 Y1.1 30.55,8.29 C3.2
N$4
  Top 0.203: R7.2 10.24,7.57 11.3,8.64 14.1,8.64 14.29,8.45 U4.12
N$5  (via drill 0.38)
  Top 0.203: v21.21,19.3 R3.2
  Bottom 0.203: SJ1.2 v21.21,19.3
N$6
  Top 0.203: Q1.1 26.41,8.29 R9.2
N$7
  Top 0.203: R8.2 9.73,6.3 11.16,7.73 U4.11
N$8
  Top 0.203: R16.2 D5.A
N$9
  Top 0.203: D3.C R6.2
N$10
  Top 0.203: R15.2 D4.A
N$11
  Top 0.203: R3.1 D2.C
N$12
  Top 0.203: Q2.1 24.39,9.99 R10.2
N$14  (via drill 0.38)
  Top 0.254: U1.3 v9.51,16.45 | S1.2 v4.92,21.11
  Bottom 0.254: v4.92,21.11 9.51,16.53 v9.51,16.45
RESET  (via drill 0.38)
  Top 0.203: U2.32 36.04,12.35 37.21,11.18 38.1,11.18 | Q1.3 25.4,2.79 JP2.5 | 38.1,11.18 v38.86,11.18 | R5.1 38.1,11.18
  Bottom 0.203: JP2.5 27.91,2.77 38.08,2.77 39.37,4.06 SJ2.2 39.37,6.6 38.86,7.11 v38.86,11.18
RTS
  Top 0.203: Q1.2 24.39,8.29 R10.1 18.73,12.42 U4.2
RXD  (via drill 0.38)
  Top 0.203: U4.4 17.46,12.33 17.35,12.22 17.35,10.18 v18.26,9.27 | R13.2 26.54,5.88 v26.54,5.97
  Bottom 0.203: v26.54,5.97 26.29,5.71 20.95,5.71 18.26,8.41 v18.26,9.27
RXLED
  Top 0.203: U4.17 17.46,9.46 15.24,11.68 13.72,11.68 13.13,12.27 13.13,14.78 13.59,15.24 13.59,17.65 13.97,18.03 D4.C
SD_!HD!
  Top 0.203: U3.7 23.65,15.49 25.55,17.4 29.59,17.4 30.1,16.89 31.11,16.89 31.26,16.74 U2.18
SD_!WP!
  Top 0.203: U2.19 31.13,16.24 30.96,16.41 29.95,16.41 29.59,16.76 U3.3
SD_CLK
  Top 0.203: U3.6 23.95,16.76 26.04,18.85 R4.1
SD_CLK0  (via drill 0.38)
  Top 0.203: U2.21 v30.3,15.24 | v29.92,18.34 29.59,18.67 28.7,18.67 26.04,21.34 R4.2
  Bottom 0.203: v30.3,15.24 30.3,17.96 v29.92,18.34
SD_CS0
  Top 0.203: U2.20 30.97,15.74 30.71,16 29.74,16 29.62,16.13 26.67,16.13 26.42,15.88 26.42,14.61 26.8,14.22 U3.1
SD_SI  (via drill 0.38)
  Top 0.203: U2.23 31.01,14.24 30.23,13.46 26.92,13.46 25.4,14.99 v25.4,16.18 | U3.5 24.16,18.03 v24.54,18.42
  Bottom 0.203: v25.4,16.18 25.4,17.55 v24.54,18.42
SD_SO
  Top 0.203: U2.22 30.87,14.74 30.61,14.48 29.87,14.48 28.85,15.49 U3.2
TRACE_ANT
  Top 0.457: SJ3.2 E1.ANT
TXD
  Top 0.203: U4.20 19.37,8.83 19.68,9.14 20.95,9.14 21.86,8.24 21.86,7.61 22.1,7.37 29.3,7.37 R12.2
TXLED
  Top 0.203: D5.C 14.28,16.76 13.99,16.49 13.99,15.06 13.65,14.72 U4.10
U0RXI  (via drill 0.38)
  Top 0.203: U2.25 32.54,12.47 32.07,12 v31.43,12 | v31.75,5.97 31.75,4.48 | JP2.7 31.75,4.06 31.75,4.48 | R12.1 31.75,4.48
  Bottom 0.203: v31.43,12 31.43,10.86 30.73,10.16 30.73,6.98 v31.75,5.97
U0TXO  (via drill 0.38)
  Top 0.203: U2.26 33.04,11.96 32.51,11.43 31.93,11.43 31.67,11.18 30.61,11.18 v30.29,11.49 | JP2.6 v29.21,5.97 28.16,5.97 R13.1
  Bottom 0.203: v30.29,11.49 30.29,7.05 v29.21,5.97
USBVCC  (via drill 0.38)
  Top 0.203: R16.1 R15.1
  Top 0.254: D1.A 11.68,13.21 12.7,14.22 12.7,15.62 v12.83,15.75 | R16.1 19.9,15.82 v20.13,15.6
  Top 0.356: F1.2 9.65,10.54 10.63,9.56 C12.1 13.27,9.56 13.51,9.8 15.47,9.8 16.19,9.08 U4.15 16.19,5.52 C13.A
  Top 0.406: F1.2 9.65,12.86 10.01,13.21 D1.A | JP2.8 34.29,3.3 v33.53,4.06 | v14.61,5.33 C13.A
  Bottom 0.254: v12.83,15.75 13.59,16.51 19.21,16.51 v20.13,15.6
  Bottom 0.406: v14.61,5.33 16.26,3.68 33.15,3.68 v33.53,4.06
VCC  (via drill 0.38, 0.51)
  Top 0.203: R2.2 39.59,15.49 38.35,15.49 v38.1,15.24 | C1.1 31.33,18.31 v31.24,18.23 30.37,19.1 28.91,19.1 26.92,21.08 26.92,22.61 26.67,22.86 25.4,22.86 24.77,22.23 R14.2 | R5.2 v39.62,8.29 | R20.1 20.74,26.18 | 20.74,26.18 Q4.1 20.74,26.28 | 26.33,26.18 R24.1 25.15,24.38 25.13,24.4 24.07,24.4 23.37,25.1 23.37,26.67 22.86,27.18 21.08,27.18 20.74,26.84 20.74,26.28 | 26.33,26.18 Q6.1 | 31.92,26.18 R26.1 30.23,24.38 28.96,25.65 28.96,26.92 28.7,27.18 26.67,27.18 26.33,26.84 26.33,26.18 | 31.92,26.18 Q7.1 | Q5.1 43.25,28.29 R22.1 41.1,28.19 40.39,28.91 40.39,30.48 39.88,30.99 37.85,30.99 37.66,30.8 Q8.1 37.66,28.29 R28.1 34.54,28.19 33.53,27.18 32.26,27.18 31.92,26.84 31.92,26.18 | 20.74,26.28 20.74,26.18
  Top 0.254: R11.2 21.34,6.18 21.34,5.97
  Top 0.279: U2.1 37.28,13.74 37.59,13.44 37.59,12.57 v37.97,12.19 | U2.11 35.04,19.25 v35.47,19.69 | U2.4 v38.1,15.24 37.6,14.74 U2.3 | U2.17 31.4,17.24 31.24,17.4 v31.24,18.23 | U2.30 v35.04,11.56 | v35.04,11.56 v35.05,11.54 | U2.29 34.54,12.06 v35.04,11.56
  Top 0.406: C2.1 35.56,11.04 v35.05,11.54 v35.05,11.55 | U1.5 11.62,18.35 11.94,18.03 | 11.94,18.03 11.94,16 11.43,15.49 11.43,14.86 | C6.1 11.43,14.86 | 11.94,18.03 13.21,19.3 D2.A D3.A 15,21.32 14.99,21.34 15.49,21.84 20.32,21.84 20.74,22.26 R20.1 | v11.68,14.61 11.43,14.86 | JP2.2 21.34,3.81 21.34,5.97 21.34,7.62 v20.7,8.25 | U3.8 22.78,13.73 C10.1 v20.7,12.95 | v29.34,12.09 v26.49,12.09
  Bottom 0.203: v39.62,8.29 39.62,11.48 38.79,12.32 38.1,12.32
  Bottom 0.406: v11.68,14.61 13.34,12.95 v20.7,12.95 20.7,10.97 | 20.7,10.97 v20.7,8.25 | v26.49,12.09 25.38,10.97 20.7,10.97 | v29.34,12.09 31.24,13.99 v31.24,18.23 34.01,18.23 v35.47,19.69 37.97,19.69 38.86,18.8 38.86,17.78 38.1,17.02 v38.1,15.24 38.1,12.32 v37.97,12.19 37.33,11.55 v35.05,11.55
VIN  (via drill 0.38)
  Top 0.203: R21.1 16.13,26.58 v16.13,26.54 | R23.1 v41.4,28.96 | v30.38,25.3 29.97,25.7 R27.1 | R29.1 v35.81,28.96 | R25.1 v24.38,25.15
  Top 0.406: JP5.2 2.29,18.03 2.74,18.49 JP6.2 5.25,18.49 JP4.2 6.55,18.35 7.11,18.35 | U1.1 7.11,18.35 | 7.11,19.3 7.11,18.35 | C5.1 7.62,19.81 v7.49,19.69 7.11,19.3 | 7.11,19.3 6.82,19.59 S1.3 | D1.C 7.62,13.21 v7.37,13.46
  Bottom 0.203: v41.4,28.96 v35.81,28.96 34.04,28.96 v30.38,25.3 26.06,25.3 25.91,25.15 v24.38,25.15 17.53,25.15 v16.13,26.54
  Bottom 0.406: v7.37,13.46 7.37,16.37 JP4.2 | v7.49,19.69 13.08,19.69 15.24,21.84 15.24,25.65 v16.13,26.54 19.05,29.46 JP3.2
VUSB
  Top 0.406: JP1.VBUS1 6,7.9 6.22,8.13 6.22,9.53 6.86,10.16 F1.1 5.71,11.05 4.45,12.32 C8.1

### Text on the board
Bottom: v10
tPlace: GND | VIN | 5 | 4 | 13 | 12 | 15 | OFF | ON | 5 | + | PWR | RX | TX | - | ESP8266 Thing Dev | GND | 3V3 | 2 | 14 | !RST! | TX | RX | 5V | NC | GND
bPlace: GND | VIN | 15 | 5 | 4 | 13 | 12 | + | PWR-LED | 3.7-6V | VIN | - | SLEEP-EN | ESP8266 Thing Dev | XPD | RST | GND | 3V3 | 2 | 14 | !RST! | TX | RX | 5V | NC | GND
Measures: Units in Inches
tDocu: Jim Lindblom